# Altium project FUTSW.PrjPcb
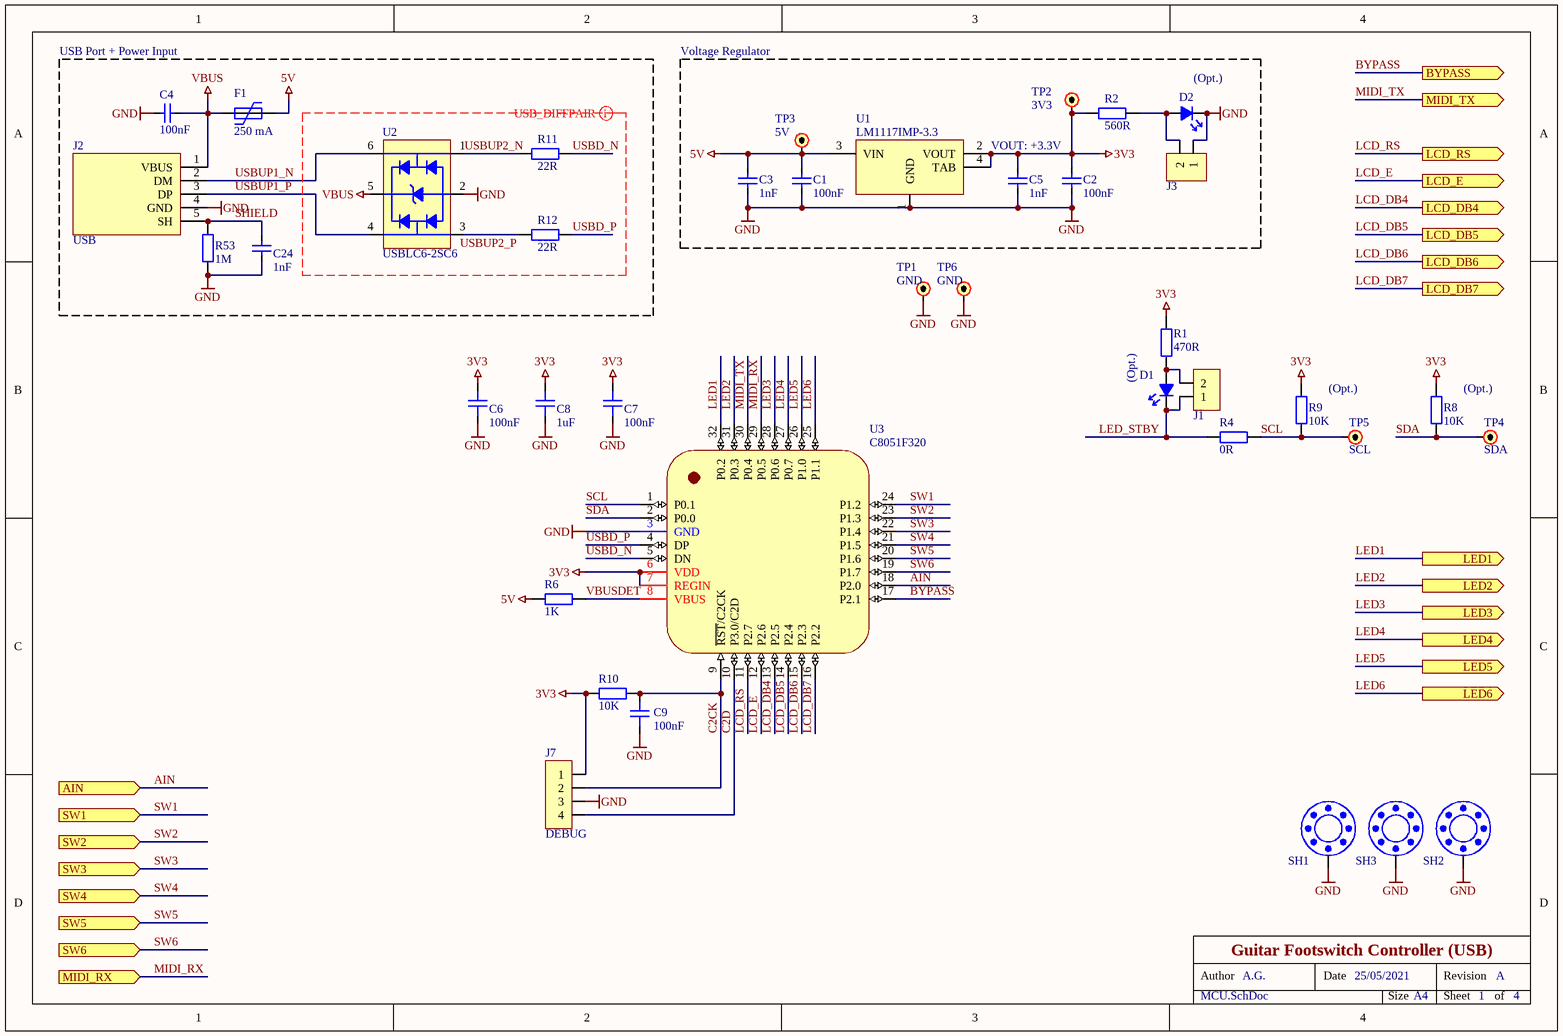
[diagram p0: MCU.SchDoc]
Date: 25/05/2021; DrawnBy: A.G.; ProjectName: FUTSW; Revision: A; SheetTotal: 4; Title: Guitar Footswitch Controller (USB)
4 sheets, 131 parts. Net scope: flat (ports and power ports of the same name join across sheets).
Board file: FUTSW.PcbDoc
Sheets:
  MCU.SchDoc
  Inputs.SchDoc
  MIDI.SchDoc
  LCD.SchDoc

## Sheet MCU.SchDoc: Guitar Footswitch Controller (USB)
size A4; Date: 25/05/2021; DrawnBy: A.G.; DocumentNumber: 1; Revision: A; SheetNumber: 1; SheetTotal: 4; ProjectName: FUTSW

### Parts
C1  100nF  [0805C_RF_M]
C2  100nF  [0805C_RF_M]
C3  1nF  [0805C_RF_M]
C4  100nF  [1206C_RF_M]
C5  1nF  [0805C_RF_M]
C6  100nF  [0603C_RF_M]
C7  100nF  [0603C_RF_M]
C8  1uF  [0603C_RF_M]
C9  100nF  [0603C_RF_M]
C24  1nF  [0603C_RF_M]
D1  LED  [0805LED_RF_M]  (value not drawn)
D2  LED  [0805LED_RF_M]  (value not drawn)
F1  250 mA  [BOURNS_MF-MSMF110/16-2_RF_H]
J1  LED  [HEADER-2.54-2P1]  (value not drawn)
J2  USB  [UJ2-BH-2-TH]
J3  PINHDR_2x1  [HEADER-2.54-2P1]  (value not drawn)
J7  DEBUG  [HEADER-2.54-4P1]
R1  470R  [0603R_RF_M]
R2  560R  [0603R_RF_M]
R4  0R  [0603R_RF_M]
R6  1K  [0805R_RF_M]
R8  10K  [0603R_RF_M]
R9  10K  [0603R_RF_M]
R10  10K  [0603R_RF_M]
R11  22R  [0603R_RF_M]
R12  22R  [0603R_RF_M]
R53  1M  [0603R_RF_M]
SH1  SH-30/57  [SH\D3.0\S5.7]  (value not drawn)
SH2  SH-30/57  [SH\D3.0\S5.7]  (value not drawn)
SH3  SH-30/57  [SH\D3.0\S5.7]  (value not drawn)
TP1  GND  [PAD_R_1.5MM]
TP2  3V3  [PAD_R_1.5MM]
TP3  5V  [PAD_R_1.5MM]
TP4  SDA  [PAD_R_1MM]
TP5  SCL  [PAD_R_1MM]
TP6  GND  [PAD_R_1.5MM]
U1  LM1117IMP-3.3  VOUT: +3.3V  [SOT-223]
U2  USBLC6-2SC6  [TI_SOT-23-6]
U3  C8051F320  [LQFP-32]

### Blocks framed on the sheet
USB Port + Power Input: C4 C24 F1 J2 R11 R12 R53 U2

### Ports
AIN (in), BYPASS (out), LCD_DB4 (out), LCD_DB5 (out), LCD_DB6 (out), LCD_DB7 (out), LCD_E (out), LCD_RS (out), LED1 (out), LED2 (out), LED3 (out), LED4 (out), LED5 (out), LED6 (out), MIDI_RX (in), MIDI_TX (out), SW1 (in), SW2 (in), SW3 (in), SW4 (in), SW5 (in), SW6 (in)

### Nets
3V3: C2.2 C5.2 C6.2 C7.2 C8.2 J7.1 R1.2 R2.2 R8.2 R9.2 R10.1 TP2.1 U1.2(VOUT) U1.4(TAB) U3.6(VDD) U3.7(REGIN)
5V: C1.2 C3.2 F1.2 R6.2 TP3.1 U1.3(VIN)
GND: C1.1 C2.1 C3.1 C4.2 C5.1 C6.1 C7.1 C8.1 C9.1 C24.1 D2.C J2.4(GND) J3.1 J7.3 R53.1 SH1.1 SH2.1 SH3.1 TP1.1 TP6.1 U1.1(GND) U2.2 U3.3(GND)
VBUS: C4.1 F1.1 J2.1(VBUS) U2.5
AIN: U3.18(P2.0) ; port AIN
BYPASS: U3.17(P2.1) ; port BYPASS
C2CK: C9.2 J7.2 R10.2 U3.9(~{RST}/C2CK)
C2D: J7.4 U3.10(P3.0/C2D)
LCD_DB4: U3.13(P2.5) ; port LCD_DB4
LCD_DB5: U3.14(P2.4) ; port LCD_DB5
LCD_DB6: U3.15(P2.3) ; port LCD_DB6
LCD_DB7: U3.16(P2.2) ; port LCD_DB7
LCD_E: U3.12(P2.6) ; port LCD_E
LCD_RS: U3.11(P2.7) ; port LCD_RS
LED1: U3.32(P0.2) ; port LED1
LED2: U3.31(P0.3) ; port LED2
LED3: U3.28(P0.6) ; port LED3
LED4: U3.27(P0.7) ; port LED4
LED5: U3.26(P1.0) ; port LED5
LED6: U3.25(P1.1) ; port LED6
LED_STBY: D1.C J1.1 R4.2
MIDI_RX: U3.29(P0.5) ; port MIDI_RX
MIDI_TX: U3.30(P0.4) ; port MIDI_TX
SCL: R4.1 R9.1 TP5.1 U3.1(P0.1)
SDA: R8.1 TP4.1 U3.2(P0.0)
SHIELD: C24.2 J2.5(SH) R53.2
SW1: U3.24(P1.2) ; port SW1
SW2: U3.23(P1.3) ; port SW2
SW3: U3.22(P1.4) ; port SW3
SW4: U3.21(P1.5) ; port SW4
SW5: U3.20(P1.6) ; port SW5
SW6: U3.19(P1.7) ; port SW6
USBD_N: R11.1 U3.5(DN)
USBD_P: R12.1 U3.4(DP)
USBUP1_N: J2.2(DM) U2.6
USBUP1_P: J2.3(DP) U2.4
USBUP2_N: R11.2 U2.1
USBUP2_P: R12.2 U2.3
VBUSDET: R6.1 U3.8(VBUS)
NetD1_A: D1.A J1.2 R1.1
NetD2_A: D2.A J3.2 R2.1

### Layout directives
differential pair: GND, USBD_N, USBD_P, USBUP2_N, USBUP2_P, VBUS

### Notes on the sheet
- Voltage Regulator
- (near D2) (Opt.)
- (Opt.)
- Author
- Date
- Revision
- Size
- A4
- Sheet
- of

### Library data of the parts
C1-C9 C24 = C: Capacitor; Manufacturer: Generic Brand; Max Voltage: ? V; Tolerance: ?; Manufacturer Part No: *; Supplier: *; Supplier Link: http://; Supplier Part No: *; Category: Capacitor; Mounting Technology: SMT
  C1 C2 C4 C6 C7 C9: Value: 100nF
  C3 C5 C24: Value: 1nF
  C8: Value: 1uF
D1 D2 = LED: Manufacturer: Generic Brand; Emitting Color: Unspecified; Forward Voltage Drop: ? V; Manufacturer Part No: *; Supplier: *; Supplier Link: http://; Supplier Part No: *; Mounting Technology: SMT; Category: Diode
F1 = PPTC: Resettable Fuse; Manufacturer: Generic Brand; Max Voltage: ? V; Hold Current: 250 mA; Category: Fuse; Mounting Technology: SMT; Supplier Link: http://
J1 J3 = PINHDR_2x1: Generic Pin Header 2x1
J2 = USBB-1J: USB Type B Receptacle; pin to pad: 5>SH; Manufacturer: Connfly; Product Number: USBB-1J (DS1099-WN0); Mounting Type: THT; Case: USB Type B; Supplier: Chipdip; Supplier Link: https://www.chipdip.by/product/usbb-1j; Supplier Part No: 249636968
J7 = PINHDR_4x1: Generic Pin Header 4x1
R1 R2 R4 R6 R8-R12 R53 = R: Resistor; Manufacturer: Generic Brand; Max Voltage: ? V; Power Rating: ? W; Tolerance: ?; Manufacturer Part No: *; Supplier: *; Supplier Link: http://; Supplier Part No: *; Category: Resistor; Mounting Technology: SMT
  R1: Value: 470R
  R2: Value: 560R
  R4: Value: 0R
  R6: Value: 1K
  R8-R10: Value: 10K
  R11 R12: Value: 22R
  R53: Value: 1M
SH1-SH3 = SH-30/57: Screw Hole D3.0/5.7 T/B
TP1-TP6 = TP: Test Point / Pad
U1 = LM1117: Voltage Regulator Linear 1% 800mA SOT-223; Manufacturer: Texas Instruments; VIN_MAX: +15V; Case: SOT-223; Product Number: LM1117IMP-3.3; Supplier: Chipdip; Supplier Link: https://www.chipdip.by/product/lm1117imp-3.3-nopb-2; Supplier Part No: 5641124530; Mounting Type: SMT
U2 = USBLC6-2SC6: Low Capacitance USB ESD Protection; Manufacturer: STMicroelectronics; Supplier Link: https://www.chipdip.by/product/usblc6-2sc6; Supplier Part No: 9000039051; Supplier: Chipdip; Case: SOT-23-6; Mounting Type: SMT; Product Name: USBLC6-2SC6
U3 = C8051F320: IC MCU 8BIT 16KB FLASH 32LQFP; Manufacturer: Silicon Labs; Manufacturer Part No: C8051F320-GQR; Mounting Technology: SMT; Package: LQFP-32; Supplier: DigiKey; Supplier Link: https://www.digikey.com/en/products/detail/silicon-labs/C8051F320-GQR/990799; Supplier Part No: C8051F320-GQRCT-ND; Alternative Supplier: Chipdip; Alternative Supplier Link: https://www.chipdip.by/product/c8051f320-gqr; Alternative Supplier Part No: 1108753860

## Sheet Inputs.SchDoc: Guitar Footswitch Controller (USB)
size A4; Date: 25/05/2021; DrawnBy: A.G.; DocumentNumber: 2; Revision: A; SheetNumber: 2; SheetTotal: 4; ProjectName: FUTSW
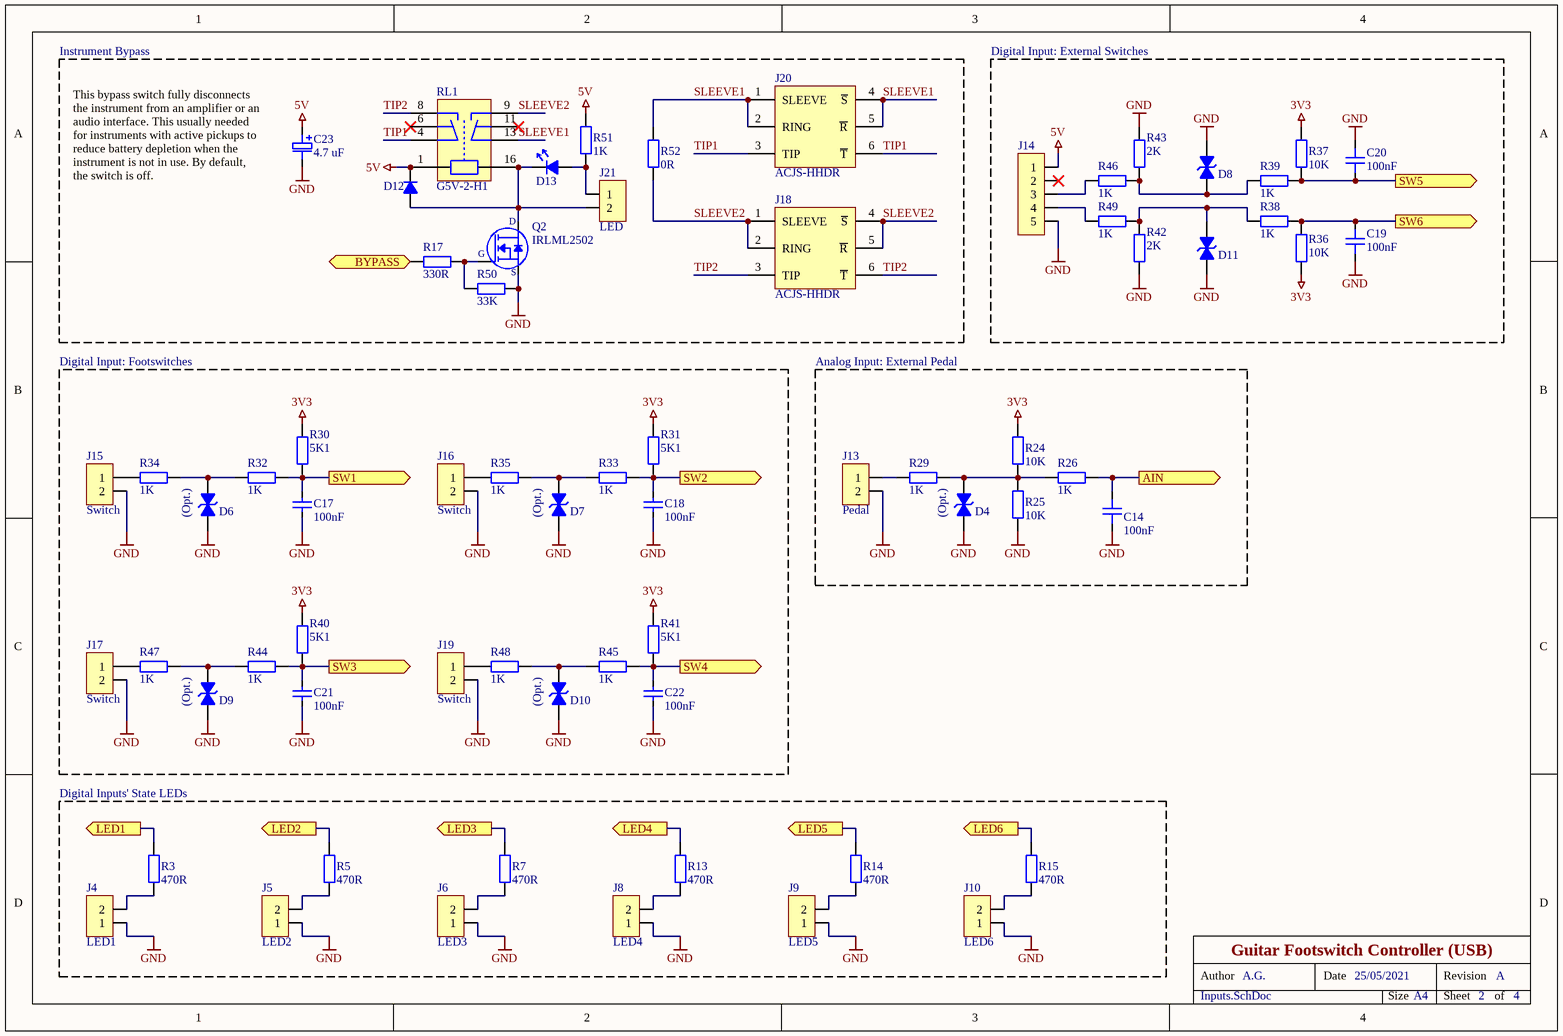
[diagram p1: Inputs.SchDoc]

### Parts
C14  100nF  [0603C_RF_M]
C17  100nF  [0603C_RF_M]
C18  100nF  [0603C_RF_M]
C19  100nF  [0603C_RF_M]
C20  100nF  [0603C_RF_M]
C21  100nF  [0603C_RF_M]
C22  100nF  [0603C_RF_M]
C23  4.7 uF  [C_EL_B_4MM_RF_M]
D4  TVS  [NXP_SOD-323_RF_M]  (value not drawn)
D6  TVS  [NXP_SOD-323_RF_M]  (value not drawn)
D7  TVS  [NXP_SOD-323_RF_M]  (value not drawn)
D8  TVS  [NXP_SOD-323_RF_M]  (value not drawn)
D9  TVS  [NXP_SOD-323_RF_M]  (value not drawn)
D10  TVS  [NXP_SOD-323_RF_M]  (value not drawn)
D11  TVS  [NXP_SOD-323_RF_M]  (value not drawn)
D12  D  [NXP_SOD-323_RF_M]  (value not drawn)
D13  LED  [0805LED_RF_M]  (value not drawn)
J4  LED1  [HEADER-2.54-2P1]
J5  LED2  [HEADER-2.54-2P1]
J6  LED3  [HEADER-2.54-2P1]
J8  LED4  [HEADER-2.54-2P1]
J9  LED5  [HEADER-2.54-2P1]
J10  LED6  [HEADER-2.54-2P1]
J13  Pedal  [HEADER-2.54-2P1]
J14  PINHDR_5x1  [HEADER-2.54-5P1]  (value not drawn)
J15  Switch  [HEADER-2.54-2P1]
J16  Switch  [HEADER-2.54-2P1]
J17  Switch  [HEADER-2.54-2P1]
J18  ACJS-HHDR  [ACJS-HHDR]
J19  Switch  [HEADER-2.54-2P1]
J20  ACJS-HHDR  [ACJS-HHDR]
J21  LED  [HEADER-2.54-2P1]
Q2  IRLML2502  [IRLML_SOT-23]
R3  470R  [0603R_RF_M]
R5  470R  [0603R_RF_M]
R7  470R  [0603R_RF_M]
R13  470R  [0603R_RF_M]
R14  470R  [0603R_RF_M]
R15  470R  [0603R_RF_M]
R17  330R  [0603R_RF_M]
R24  10K  [0603R_RF_M]
R25  10K  [0603R_RF_M]
R26  1K  [0603R_RF_M]
R29  1K  [0603R_RF_M]
R30  5K1  [0603R_RF_M]
R31  5K1  [0603R_RF_M]
R32  1K  [0603R_RF_M]
R33  1K  [0603R_RF_M]
R34  1K  [0603R_RF_M]
R35  1K  [0603R_RF_M]
R36  10K  [0603R_RF_M]
R37  10K  [0603R_RF_M]
R38  1K  [0603R_RF_M]
R39  1K  [0603R_RF_M]
R40  5K1  [0603R_RF_M]
R41  5K1  [0603R_RF_M]
R42  2K  [0603R_RF_M]
R43  2K  [0603R_RF_M]
R44  1K  [0603R_RF_M]
R45  1K  [0603R_RF_M]
R46  1K  [0603R_RF_M]
R47  1K  [0603R_RF_M]
R48  1K  [0603R_RF_M]
R49  1K  [0603R_RF_M]
R50  33K  [0603R_RF_M]
R51  1K  [0603R_RF_M]
R52  0R  [0805R_RF_M]
RL1  G5V-2-H1  [G5V-2-H1]

### Blocks framed on the sheet
Instrument Bypass: C23 D12 D13 J18 J20 J21 Q2 R17 R50-R52 RL1
Digital Input: External Switches: C19 C20 D8 D11 J14 R36-R39 R42 R43 R46 R49
Digital Inputs' State LEDs: J4-J6 J8-J10 R3 R5 R7 R13-R15

### Ports
AIN (out), BYPASS (in), LED1 (out), LED2 (out), LED3 (out), LED4 (out), LED5 (out), LED6 (out), SW1 (out), SW2 (out), SW3 (out), SW4 (out), SW5 (out), SW6 (out)

### Nets
3V3: R24.2 R30.1 R31.1 R36.2 R37.2 R40.1 R41.1
5V: C23.P D12.C J14.1 R51.2 RL1.1(SW)
GND: C14.1 C17.1 C18.1 C19.2 C20.1 C21.1 C22.1 C23.N D4.A D6.A D7.A D8.A D9.A D10.A D11.A J4.1 J5.1 J6.1 J8.1 J9.1 J10.1 J13.2 J14.5 J15.2 J16.2 J17.2 J19.2 Q2.2(S) R25.1 R42.2 R43.1 R50.2
AIN: C14.2 R26.2 ; port AIN
BYPASS: R17.1 ; port BYPASS
LED1: R3.2 ; port LED1
LED2: R5.2 ; port LED2
LED3: R7.2 ; port LED3
LED4: R13.2 ; port LED4
LED5: R14.2 ; port LED5
LED6: R15.2 ; port LED6
SLEEVE1: J20.1(SLEEVE) J20.2(RING) J20.4(~{S}) J20.5(~{R}) R52.2 RL1.13(COM2)
SLEEVE2: J18.1(SLEEVE) J18.2(RING) J18.4(~{S}) J18.5(~{R}) R52.1 RL1.9(NO2)
SW1: C17.2 R30.2 R32.2 ; port SW1
SW2: C18.2 R31.2 R33.2 ; port SW2
SW3: C21.2 R40.2 R44.2 ; port SW3
SW4: C22.2 R41.2 R45.2 ; port SW4
SW5: C20.2 R37.1 R39.2 ; port SW5
SW6: C19.1 R36.1 R38.2 ; port SW6
TIP1: J20.3(TIP) J20.6(~{T}) RL1.4(COM1)
TIP2: J18.3(TIP) J18.6(~{T}) RL1.8(NO1)
NetD4_C: D4.C R24.1 R25.2 R26.1 R29.2
NetD6_C: D6.C R32.1 R34.2
NetD7_C: D7.C R33.1 R35.2
NetD8_C: D8.C R39.1 R43.2 R46.2
NetD9_C: D9.C R44.1 R47.2
NetD10_C: D10.C R45.1 R48.2
NetD11_C: D11.C R38.1 R42.1 R49.2
NetD12_A: D12.A D13.C J21.2 Q2.3(D) RL1.16(SW)
NetD13_A: D13.A J21.1 R51.1
NetJ4_2: J4.2 R3.1
NetJ5_2: J5.2 R5.1
NetJ6_2: J6.2 R7.1
NetJ8_2: J8.2 R13.1
NetJ9_2: J9.2 R14.1
NetJ10_2: J10.2 R15.1
NetJ13_1: J13.1 R29.1
NetJ14_3: J14.3 R46.1
NetJ14_4: J14.4 R49.1
NetJ15_1: J15.1 R34.1
NetJ16_1: J16.1 R35.1
NetJ17_1: J17.1 R47.1
NetJ19_1: J19.1 R48.1
NetQ2_1: Q2.1(G) R17.2 R50.1

Not connected (* = marked no-connect by the designer): J14 2*; RL1 6(NC1)* 11(NC2)*

### Notes on the sheet
- (near C23) This bypass switch fully disconnects the instrument from an amplifier or an audio interface. This usually needed for instruments with active pickups to reduce battery depletion when the instrument is not in use. By default, the switch is off.
- Digital Input: Footswitches
- Analog Input: External Pedal
- (Opt.)
- (near R29) (Opt.)
- Author
- Date
- Revision
- Size
- A4
- Sheet
- of

### Library data of the parts
C14 C17-C22 = C: as C1 on sheet MCU; Value: 100nF; Tolerance: ?; Manufacturer Part No: *; Supplier: *; Supplier Link: http://; Supplier Part No: *; Category: Capacitor; Mounting Technology: SMT
C23 = C-P: Polarized Capacitor; Manufacturer: Generic Brand; Max Voltage: ? V; Value: 4.7 uF; Mounting Technology: SMT; Tolerance: ?; Tag: *; Manufacturer Part No: *; Supplier: *; Supplier Link: http://; Supplier Part No: *; Category: Capacitor
D4 D6-D11 = D-TVS: TVS Diode Bidirectional; Manufacturer: Generic Brand; Power Rating: ? W; Manufacturer Part No: *; Supplier: *; Supplier Link: http://; Supplier Part No: *; Mounting Technology: SMT; Category: Diode
D12 = D: Diode (Rectifier); Manufacturer: Generic Brand; Max Forward Voltage: ? V; Power Rating: ? W; Manufacturer Part No: *; Supplier: *; Supplier Link: http://; Supplier Part No: *; Mounting Technology: SMT; Category: Diode
D13 = LED: as D1 on sheet MCU; Manufacturer Part No: *; Supplier: *; Supplier Link: http://; Supplier Part No: *; Mounting Technology: SMT; Category: Diode
J4-J6 J8-J10 J15-J17 J19 J21 = PINHDR_2x1: Generic Pin Header 2x1
J13 = PINHDR-2P1: Pin Header Single Row 2 Positions; Mounting Technology: THT
J14 = PINHDR_5x1: Generic Pin Header 5x1
J18 J20 = ACJS-HHDR: 1/4" Stereo Jack PCB Receptacle; Manufacturer: Amphenol; Manufacturer Product No: ACJM-HHDR; Alternative Supplier: Belchip; Alternative Supplier Link: https://belchip.by/product/?selected_product=44079; Alternative Supplier Part No: 44079; Mounting Technology: HMT
Q2 = IRLML2502: MOSFET N-CH 20V 4.2A SOT23; Manufacturer: Infineon; Manufacturer Part No: IRLML2502TRPBF; Supplier: DigiKey; Supplier Link: https://www.digikey.com/en/products/detail/infineon-technologies/IRLML2502TRPBF/811439; Supplier Part No: IRLML2502TRPBFCT-ND; Mounting Technology: SMT; Package: SOT-23; Alternative Supplier: Chipdip; Alternative Supplier Part No: 517112745; Alternative Supplier Link: https://www.chipdip.by/product/irlml2502tr
R3 R5 R7 R13-R15 R17 R24-R26 R29-R52 = R: as R1 on sheet MCU; Tolerance: ?; Manufacturer Part No: *; Supplier: *; Supplier Link: http://; Supplier Part No: *; Category: Resistor; Mounting Technology: SMT
  R3 R5 R7 R13-R15: Value: 470R
  R17: Value: 330R
  R24 R25 R36 R37: Value: 10K
  R26 R29 R32-R35 R38 R39 R44-R49 R51: Value: 1K
  R30 R31 R40 R41: Value: 5K1
  R42 R43: Value: 2K
  R50: Value: 33K
  R52: Value: 0R
RL1 = G5V-2-H1: RELAY GEN PURPOSE DPDT 1A 5VDC; Manufacturer: Omron; Manufacturer Part No: G5V-2-H1 DC5; Compatible Model: TIANBO HJR1-2C; Alternative Supplier Link: https://belchip.by/product/?selected_product=32041; Alternative Supplier: Belchip; Alternative Supplier Part No: 32041; Mounting Technology: THT; Supplier Part No: Z108-ND; Supplier Link: https://www.digikey.com/en/products/detail/omron-electronics-inc-emc-div/G5V-2-H1-DC5/277844; Supplier: DigiKey

## Sheet MIDI.SchDoc: Guitar Footswitch Controller (USB)
size A4; Date: 25/05/2021; DrawnBy: A.G.; DocumentNumber: 3; Revision: A; SheetNumber: 3; SheetTotal: 4; ProjectName: FUTSW
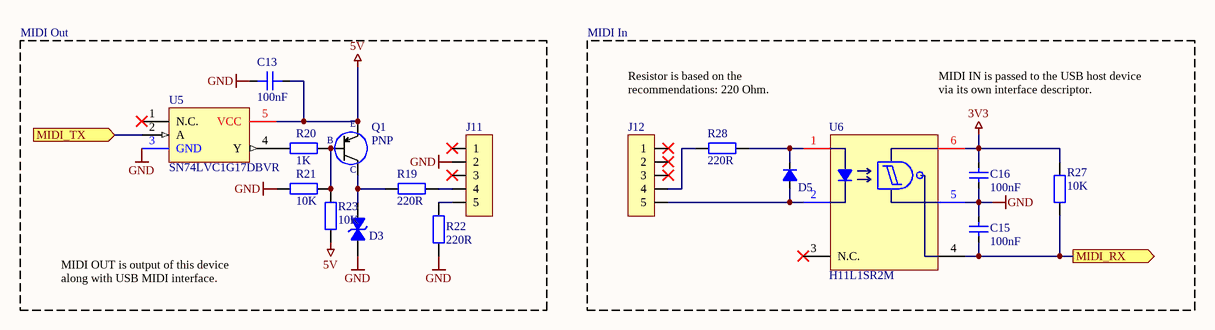
[diagram p2: MIDI.SchDoc]

### Parts
C13  100nF  [0603C_RF_M]
C15  100nF  [0603C_RF_M]
C16  100nF  [0603C_RF_M]
D3  TVS  [NXP_SOD-323_RF_M]  (value not drawn)
D5  D  [NXP_SOD-323_RF_M]  (value not drawn)
J11  PINHDR-5P1  [HEADER-2.54-5P1]  (value not drawn)
J12  PINHDR-5P1  [HEADER-2.54-5P1]  (value not drawn)
Q1  PNP  [SOT-23-3]
R19  220R  [0603R_RF_M]
R20  1K  [0603R_RF_M]
R21  10K  [0603R_RF_M]
R22  220R  [0603R_RF_M]
R23  10K  [0603R_RF_M]
R27  10K  [0603R_RF_M]
R28  220R  [0603R_RF_M]
U5  SN74LVC1G17DBVR  [TI_SOT-23-5]
U6  H11L1SR2M  [H11L1SR2M_SMD-6]

### Blocks framed on the sheet
MIDI Out: C13 D3 J11 Q1 R19-R23 U5
MIDI In: C15 C16 D5 J12 R27 R28 U6

### Ports
MIDI_RX (out), MIDI_TX (in)

### Nets
3V3: C16.2 R27.1 U6.6(VCC)
5V: C13.2 Q1.E(Emmiter) R23.2 U5.5(VCC)
GND: C13.1 C15.2 C16.1 D3.A J11.2 R21.2 R22.1 U5.3(GND) U6.5(GND)
MIDI_RX: C15.1 R27.2 U6.4(OUT) ; port MIDI_RX
MIDI_TX: U5.2(A) ; port MIDI_TX
NetD3_C: D3.C Q1.C(Collector) R19.1
NetD5_A: D5.A J12.5 U6.2(C)
NetD5_C: D5.C R28.2 U6.1(A)
NetJ11_4: J11.4 R19.2
NetJ11_5: J11.5 R22.2
NetJ12_4: J12.4 R28.1
NetQ1_B: Q1.B(Base) R20.1 R21.1 R23.1
NetR20_2: R20.2 U5.4(Y)

Not connected (* = marked no-connect by the designer): J11 1* 3*; J12 1* 2* 3*; U5 1(N.C.)*; U6 3(N.C.)*

### Notes on the sheet
- Resistor is based on the recommendations: 220 Ohm.
- MIDI IN is passed to the USB host device via its own interface descriptor.
- MIDI OUT is output of this device along with USB MIDI interface.
- Author
- Date
- Revision
- Size
- A4
- Sheet
- of

### Library data of the parts
C13 C15 C16 = C: as C1 on sheet MCU; Value: 100nF; Tolerance: ?; Tag: *; Manufacturer Part No: *; Supplier: *; Supplier Link: http://; Supplier Part No: *; Category: Capacitor; Mounting Technology: SMT
D3 = D-TVS: as D4 on sheet Inputs; Manufacturer Part No: *; Supplier: *; Supplier Link: http://; Supplier Part No: *; Mounting Technology: SMT; Category: Diode
D5 = D: as D12 on sheet Inputs; Manufacturer Part No: *; Supplier: *; Supplier Link: http://; Supplier Part No: *; Mounting Technology: SMT; Category: Diode
J11 J12 = PINHDR-5P1: Generic Pin Header 5x1
Q1 = PNP: Bipolar Transistor PNP; pin to pad: B>1 C>3 E>2; Manufacturer: Generic Brand; IGS: ? A; VDS: ? V; Power Rating: ? W; Manufacturer Part No: *; Supplier: *; Supplier Link: http://; Supplier Part No: *; Mounting Technology: SMT; Category: Transistor; VGS: ? V
R19-R23 R27 R28 = R: as R1 on sheet MCU; Tolerance: ?; Manufacturer Part No: *; Supplier: *; Supplier Link: http://; Supplier Part No: *; Category: Resistor; Mounting Technology: SMT
  R19 R22 R28: Value: 220R
  R20: Value: 1K
  R21 R23 R27: Value: 10K
U5 = SN74LVC1G17DBVR: IC BUF NON-INVERT 5.5V SOT23-5; Manufacturer: Texas Instruments; Supplier Part No: 296-11933-1-ND; Supplier URL: https://www.digikey.com/en/products/detail/texas-instruments/SN74LVC1G17DBVR/389051; Supplier Unit Price: $0.29; Supplier Packaging: Cut Tape; Manufacturer Product Number: SN74LVC1G17DBVR; Operating Temperature: -40°C ~ 125°C (TA); Mounting Type: SMT; Package: SOT-23-5
U6 = H11L1SR2M: OPTOISO 4.17KV OPN COLL SMD-6; Manufacturer: ON Semiconductor; Supplier URL: https://www.digikey.com/en/products/detail/on-semiconductor/H11L1SR2M/458856; Supplier Part No: H11L1SR2MCT-ND; Manufacturer Part No: H11L1SR2M; Mounting Type: SMT; Package: SMD-6; Supplier: DigiKey; Alternative Supplier: Chipdip; Alternative Supplier Link: https://www.chipdip.by/product/h11l1sr2m; Alternative Supplier Part No: 753715628

## Sheet LCD.SchDoc: Guitar Footswitch Controller (USB)
size A4; Date: 25/05/2021; DrawnBy: A.G.; DocumentNumber: 4; Revision: A; SheetNumber: 4; SheetTotal: 4; ProjectName: FUTSW
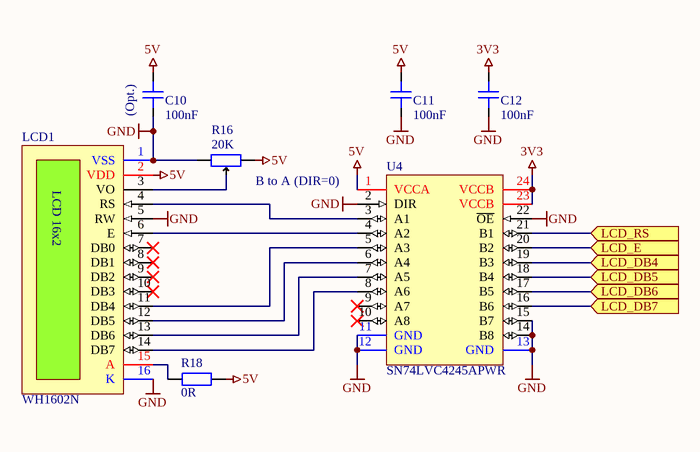
[diagram p3: LCD.SchDoc]

### Parts
C10  100nF  [0603C_RF_M]
C11  100nF  [0603C_RF_M]
C12  100nF  [0603C_RF_M]
LCD1  WH1602N  [PINHDR-16P1-2.54]
R16  20K  [BOURNS_3362P]
R18  0R  [0603R_RF_M]
U4  SN74LVC4245APWR  [TI_TSSOP-24]

### Ports
LCD_DB4 (in), LCD_DB5 (in), LCD_DB6 (in), LCD_DB7 (in), LCD_E (in), LCD_RS (in)

### Nets
3V3: C12.2 U4.23(VCCB) U4.24(VCCB)
5V: C10.2 C11.2 LCD1.2(VDD) R16.1 R18.1 U4.1(VCCA)
GND: C10.1 C11.1 C12.1 LCD1.1(VSS) LCD1.5(RW) LCD1.16(K) R16.2 U4.2(DIR) U4.11(GND) U4.12(GND) U4.13(GND) U4.14(B8) U4.15(B7) U4.22(~{OE})
LCD_DB4: U4.19(B3) ; port LCD_DB4
LCD_DB5: U4.18(B4) ; port LCD_DB5
LCD_DB6: U4.17(B5) ; port LCD_DB6
LCD_DB7: U4.16(B6) ; port LCD_DB7
LCD_E: U4.20(B2) ; port LCD_E
LCD_RS: U4.21(B1) ; port LCD_RS
NetLCD1_3: LCD1.3(VO) R16.3
NetLCD1_4: LCD1.4(RS) U4.3(A1)
NetLCD1_6: LCD1.6(E) U4.4(A2)
NetLCD1_11: LCD1.11(DB4) U4.5(A3)
NetLCD1_12: LCD1.12(DB5) U4.6(A4)
NetLCD1_13: LCD1.13(DB6) U4.7(A5)
NetLCD1_14: LCD1.14(DB7) U4.8(A6)
NetLCD1_15: LCD1.15(A) R18.2

Not connected (* = marked no-connect by the designer): LCD1 7(DB0)* 8(DB1)* 9(DB2)* 10(DB3)*; U4 9(A7)* 10(A8)*

### Notes on the sheet
- (near C10) (Opt.)
- (near R16) B to A (DIR=0)
- Author
- Date
- Revision
- Size
- A4
- Sheet
- of
- (in symbol WH1602N) LCD 16x2

### Library data of the parts
C10-C12 = C: as C1 on sheet MCU; Value: 100nF; Tolerance: ?; Manufacturer Part No: *; Supplier: *; Supplier Link: http://; Supplier Part No: *; Category: Capacitor; Mounting Technology: SMT
LCD1 = WH1602N: Dot Matrix Character LCD Module 16x2; Manufacturer: Winstar; Manufacturer Part No: WH1602B-YYH-CTK; Supplier Link: https://www.chipdip.by/product/wh1602b-yyh-ctk; Supplier: Chipdip; Supplier Part No: 9000032691; Mounting Technology: THT
R16 = POT: Generic Potentiometer / Variable Resistor; Tolerance: 1%; Value: 20K; Tag: *; Mounting Type: THT; Manufacturer: *; Manufacturer Part No: *; Supplier: *; Supplier Link: http://; Supplier Part No: *
R18 = R: as R1 on sheet MCU; Value: 0R; Tolerance: ?; Manufacturer Part No: *; Supplier: *; Supplier Link: http://; Supplier Part No: *; Category: Resistor; Mounting Technology: SMT
U4 = SN74LVC4245APWR: Octal Bus Transceiver And 3.3-V To 5-V Shifter With 3-State Outputs; Manufacturer: Texas Instruments; Supplier: Chipdip; Supplier Link: https://www.chipdip.by/product/sn74lvc4245apwr; Supplier Part No: 9000247069; Manufacturer Part No: SN74LVC4245APWR

## Nets that join several sheets
3V3: MCU (16 pins), Inputs (7 pins), MIDI (C16.2 R27.1 U6.6), LCD (C12.2 U4.23 U4.24)
5V: MCU (6 pins), Inputs (5 pins), MIDI (C13.2 Q1.E R23.2 U5.5), LCD (6 pins)
GND: MCU (23 pins), Inputs (32 pins), MIDI (9 pins), LCD (14 pins)
AIN: MCU (U3.18), Inputs (C14.2 R26.2)
BYPASS: MCU (U3.17), Inputs (R17.1)
LCD_DB4: MCU (U3.13), LCD (U4.19)
LCD_DB5: MCU (U3.14), LCD (U4.18)
LCD_DB6: MCU (U3.15), LCD (U4.17)
LCD_DB7: MCU (U3.16), LCD (U4.16)
LCD_E: MCU (U3.12), LCD (U4.20)
LCD_RS: MCU (U3.11), LCD (U4.21)
LED1: MCU (U3.32), Inputs (R3.2)
LED2: MCU (U3.31), Inputs (R5.2)
LED3: MCU (U3.28), Inputs (R7.2)
LED4: MCU (U3.27), Inputs (R13.2)
LED5: MCU (U3.26), Inputs (R14.2)
LED6: MCU (U3.25), Inputs (R15.2)
MIDI_RX: MCU (U3.29), MIDI (C15.1 R27.2 U6.4)
MIDI_TX: MCU (U3.30), MIDI (U5.2)
SW1: MCU (U3.24), Inputs (C17.2 R30.2 R32.2)
SW2: MCU (U3.23), Inputs (C18.2 R31.2 R33.2)
SW3: MCU (U3.22), Inputs (C21.2 R40.2 R44.2)
SW4: MCU (U3.21), Inputs (C22.2 R41.2 R45.2)
SW5: MCU (U3.20), Inputs (C20.2 R37.1 R39.2)
SW6: MCU (U3.19), Inputs (C19.1 R36.1 R38.2)